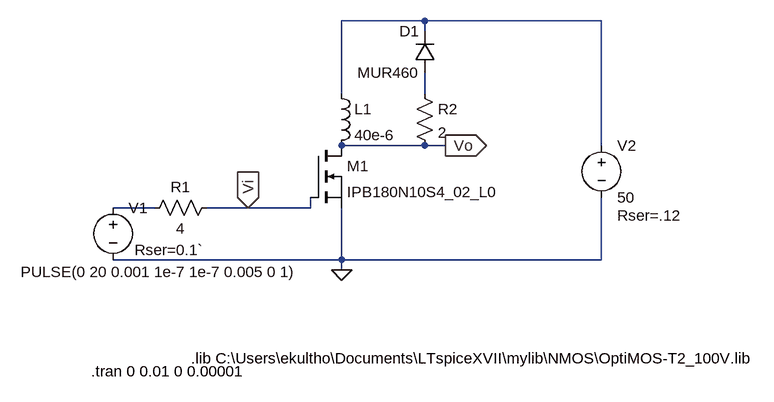
[diagram p0: schematic AntiParallel Diode Config.asc]
AntiParallel Diode Config.asc, the LTspice schematic file:
Version 4
SHEET 1 916 680
WIRE 240 -96 112 -96
WIRE 512 -96 240 -96
WIRE 240 -80 240 -96
WIRE 112 16 112 -96
WIRE 240 16 240 -16
WIRE 240 96 112 96
WIRE 272 96 240 96
WIRE 512 96 512 -96
WIRE -176 192 -240 192
WIRE -32 192 -96 192
WIRE 64 192 64 176
WIRE 64 192 -32 192
WIRE 112 272 112 192
WIRE 112 272 -240 272
WIRE 512 272 512 176
WIRE 512 272 112 272
WIRE 112 288 112 272
FLAG 112 288 0
FLAG 272 96 Vo
IOPIN 272 96 Out
FLAG -32 192 Vi
IOPIN -32 192 In
SYMBOL nmos 64 96 R0
SYMATTR InstName M1
SYMATTR Value IPB180N10S4_02_L0
SYMATTR Prefix X
SYMBOL voltage -240 176 R0
WINDOW 3 -142 115 Left 2
WINDOW 123 24 124 Left 2
WINDOW 39 33 81 Left 2
SYMATTR InstName V1
SYMATTR Value PULSE(0 20 0.001 1e-7 1e-7 0.005 0 1)
SYMATTR SpiceLine Rser=0.1`
SYMBOL voltage 512 80 R0
WINDOW 123 0 0 Left 0
WINDOW 39 24 124 Left 2
SYMATTR InstName V2
SYMATTR Value 50
SYMATTR SpiceLine Rser=.12
SYMBOL ind 96 0 R0
SYMATTR InstName L1
SYMATTR Value 40e-6
SYMATTR SpiceLine Rser=.2 Cpar=1e-9
SYMBOL res -80 176 R90
WINDOW 0 0 56 VBottom 2
WINDOW 3 32 56 VTop 2
SYMATTR InstName R1
SYMATTR Value 4
SYMBOL diode 256 -16 R180
WINDOW 0 24 64 Left 2
WINDOW 3 24 0 Left 2
SYMATTR InstName D1
SYMATTR Value MUR460
SYMBOL res 224 0 R0
SYMATTR InstName R2
SYMATTR Value 2
TEXT -120 424 Left 2 !.lib C:\\Users\\ekultho\\Documents\\LTspiceXVII\\mylib\\NMOS\\OptiMOS-T2_100V.lib
TEXT -274 444 Left 2 !.tran 0 0.01 0 0.00001

The netlist it stands for:
* AntiParallel Diode Config.asc
XM1 Vo Vi 0 IPB180N10S4_02_L0  ; pins D G S
V1 N003 0 PULSE(0 20 0.001 1e-7 1e-7 0.005 0 1) Rser=0.1`
V2 N001 0 50 Rser=.12
L1 N001 Vo 40e-6 Rser=.2 Cpar=1e-9
R1 Vi N003 4
D1 N002 N001 MUR460
R2 N002 Vo 2
.model D D
.lib standard.dio
.lib C:\Users\ekultho\Documents\LTspiceXVII\mylib\NMOS\OptiMOS-T2_100V.lib
.tran 0 0.01 0 0.00001
.backanno
.end

* Results of the author's LTspice run, read from the files saved beside the schematic
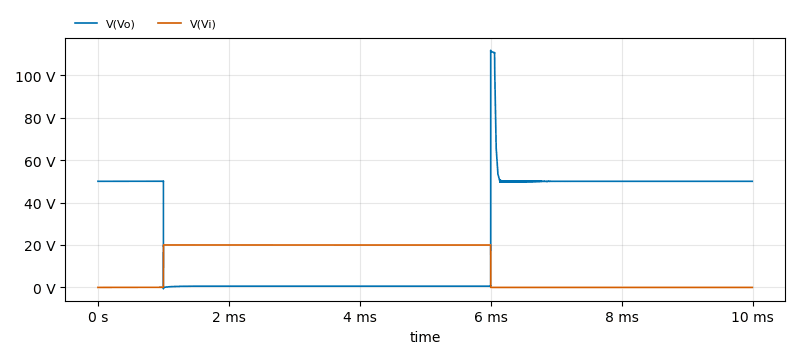
[diagram p1: Transient Analysis of AntiParallel Diode Config.asc, plotted from the saved traces]
* Transient Analysis, 1 run:
*   V(Vo): min -663.8 mV, max 111.9 V, average 25.76 V, rms 36.36 V, last 50 V
*   V(Vi): min -50.03 mV, max 20 V, average 10 V, rms 14.14 V, last 20.5 µV